# EAGLE design shiftLight (EAGLE 7.1.0)
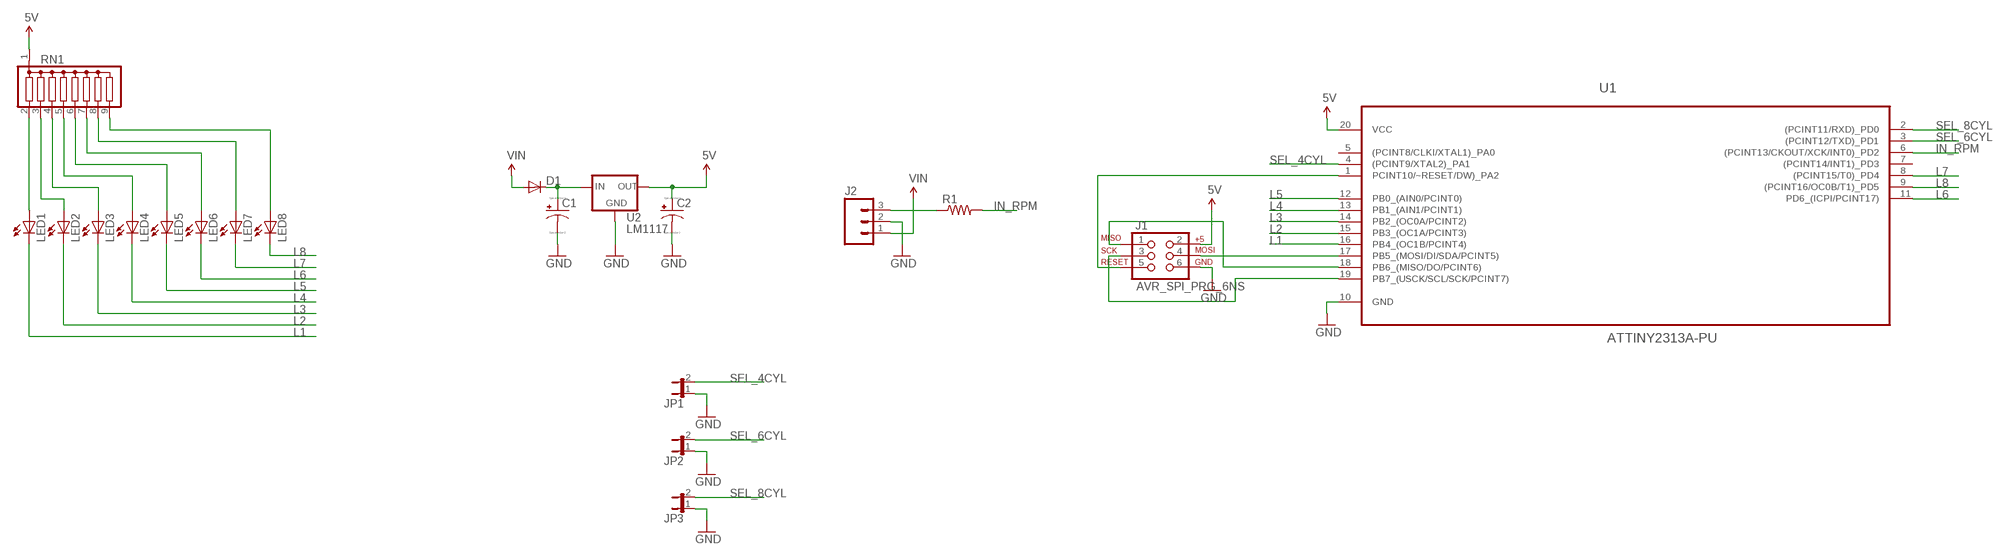
[diagram p0: schematic, sheet 1]

## Parts
C1  CPOL-USE3.5-8  [E3,5-8]
C2  CPOL-USE3.5-8  [E3,5-8]
D1  DIODEPTH  [DIODE-1N4001]
J1  AVR_SPI_PRG_6NS  [2X3-NS]
J2  M03SCREW  [SCREWTERMINAL-3.5MM-3]
JP1  JUMPER-2SMD-NO  [SJ_2S-NO]
JP2  JUMPER-2SMD-NO  [SJ_2S-NO]
JP3  JUMPER-2SMD-NO  [SJ_2S-NO]
LED1  LED5MM  [LED5MM]
LED2  LED5MM  [LED5MM]
LED3  LED5MM  [LED5MM]
LED4  LED5MM  [LED5MM]
LED5  LED5MM  [LED5MM]
LED6  LED5MM  [LED5MM]
LED7  LED5MM  [LED5MM]
LED8  LED5MM  [LED5MM]
R1  RESISTORPTH-1/4W  [AXIAL-0.4]
RN1  G08R  [SIL9]
U1  ATTINY2313A-PU  [DIP254P762X533-20]
U2  LM1117  V_REG_78XX-TO-220  [TO-220-ALT]

## Nets
5V: C2.+ J1.2 RN1.1 U1.20(VCC) U2.OUT
GND: C1.- C2.- J1.6 J2.2 JP1.1 JP2.1 JP3.1 U1.10(GND) U2.GND
IN_RPM: R1.P$2 U1.6((PCINT13/CKOUT/XCK/INT0)_PD2)
L1: LED1.K(C) U1.16(PB4_(OC1B/PCINT4))
L2: LED2.K(C) U1.15(PB3_(OC1A/PCINT3))
L3: LED3.K(C) U1.14(PB2_(OC0A/PCINT2))
L4: LED4.K(C) U1.13(PB1_(AIN1/PCINT1))
L5: LED5.K(C) U1.12(PB0_(AIN0/PCINT0))
L6: LED6.K(C) U1.11(PD6_(ICPI/PCINT17))
L7: LED7.K(C) U1.8((PCINT15/T0)_PD4)
L8: LED8.K(C) U1.9((PCINT16/OC0B/T1)_PD5)
N$1: LED1.A RN1.2
N$2: LED2.A RN1.3
N$3: LED3.A RN1.4
N$4: LED4.A RN1.5
N$5: LED5.A RN1.6
N$6: LED6.A RN1.7
N$7: LED7.A RN1.8
N$8: J2.3 R1.P$1
N$9: C1.+ D1.C U2.IN
N$10: J1.4 U1.17(PB5_(MOSI/DI/SDA/PCINT5))
N$11: J1.3 U1.19(PB7_(USCK/SCL/SCK/PCINT7))
N$12: J1.1 U1.18(PB6_(MISO/DO/PCINT6))
N$13: J1.5 U1.1(PCINT10/~RESET/DW)_PA2)
N$14: LED8.A RN1.9
SEL_4CYL: JP1.2 U1.4((PCINT9/XTAL2)_PA1)
SEL_6CYL: JP2.2 U1.3((PCINT12/TXD)_PD1)
SEL_8CYL: JP3.2 U1.2((PCINT11/RXD)_PD0)
VIN: D1.A J2.1
Unconnected: U1.5((PCINT8/CLKI/XTAL1)_PA0) U1.7((PCINT14/INT1)_PD3)

## Library data of the parts
C1 C2 = resistor:CPOL-US: POLARIZED CAPACITOR, American symbol
D1 = SparkFun-DiscreteSemi:DIODE: Diode These are standard reverse protection diodes and small signal diodes. SMA package can handle up to about 1A. SOD-323 can handle about 200mA. What the SOD-323 package when ordering, there are some mfgs out there that are 5-pin packages.
J1 = SparkFun-Connectors:AVR_SPI_PRG_6: AVR ISP 6 Pin This is the reduced ISP connector for AVR programming. Common on Arduino. This footprint will take up less PCB space and can be used with a 10-pin to 6-pin adapter such as SKU: BOB-08508
J2 = SparkFun-Connectors:M03: Header 3 Standard 3-pin 0.1" header. Use with straight break away headers (SKU : PRT-00116), right angle break away headers (PRT-00553), swiss pins (PRT-00743), machine pins (PRT-00117), and female headers (PRT-00115). Molex polarized connector foot print use with SKU : PRT-08232 with associated crimp pins and housings.
JP1-JP3 = SparkFun-Passives:JUMPER-2: Jumper Basic 0.1" spaced jumper. Use with breakaway headers.
LED1-LED8 = SparkFun-LED:LED: LEDs Standard schematic elements and footprints for 5mm, 3mm, 1206, and 0603 sized LEDs. 5mm - Spark Fun Electronics SKU : COM-00529 (and others)
R1 = SparkFun-Resistors:RESISTOR: Resistor Basic schematic elements and footprints for 0603, 1206, and PTH resistors.
RN1 = resistor-sil:G08R: SIL RESISTOR; OC_FARNELL: unknown; OC_NEWARK: unknown
U1 = Atmel_By_element14_Batch_1-00:ATTINY2313A-PU: 8-bit Microcontroller; DESCRIPTION: 8-bit Microcontroller; MPN: ATTINY2313A-PU; OC_FARNELL: 1841616; OC_NEWARK: 12T1333; PACKAGE: DIP-20; SUPPLIER: Atmel
U2 = SparkFun-PowerIC:V_REG_78XX: Voltage Regulator Standard 7805 5V regulator. IGO (Input Ground Output). Spark Fun Electronics SKU : COM-00107

## Board
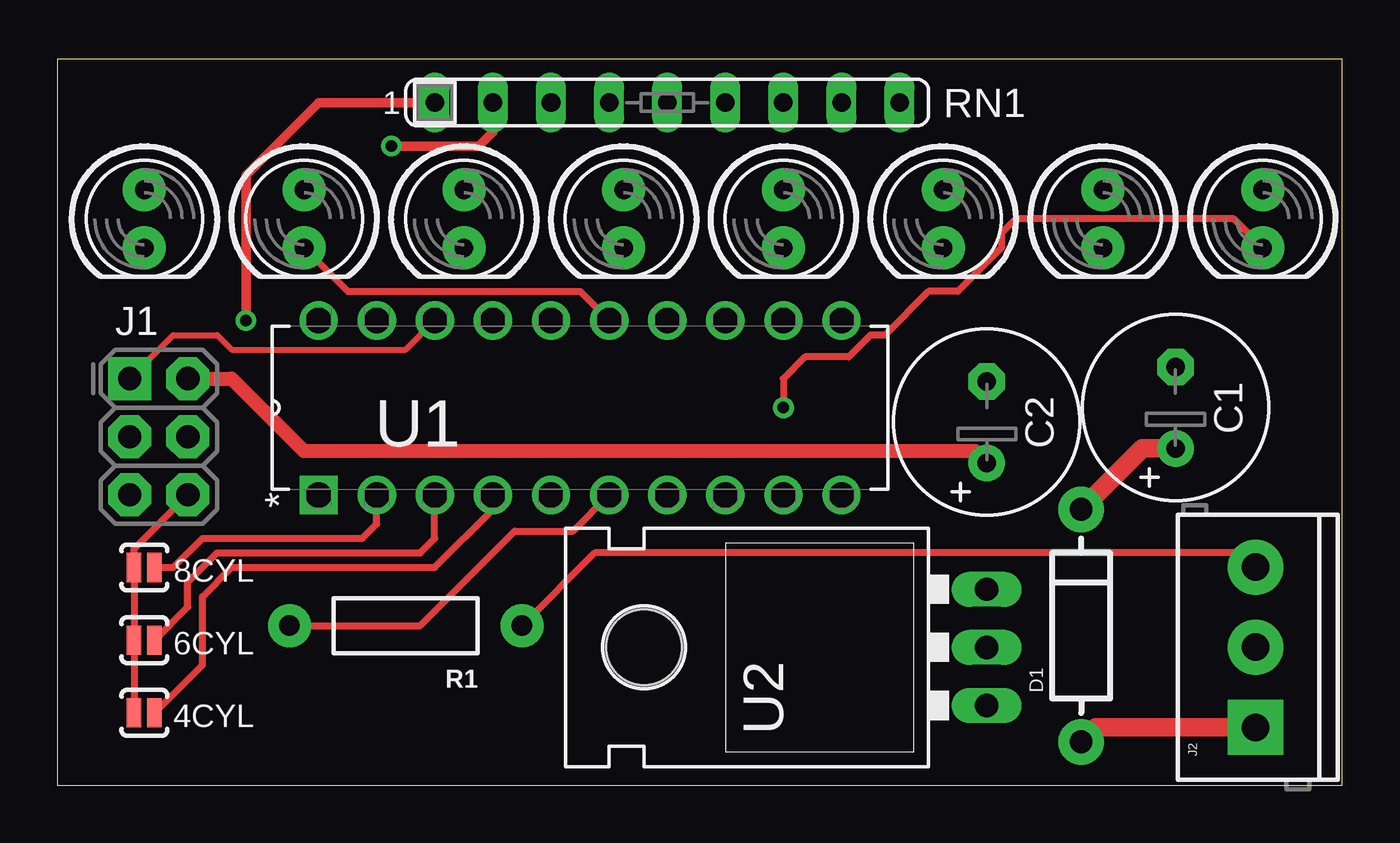
[diagram p1: board, top side]
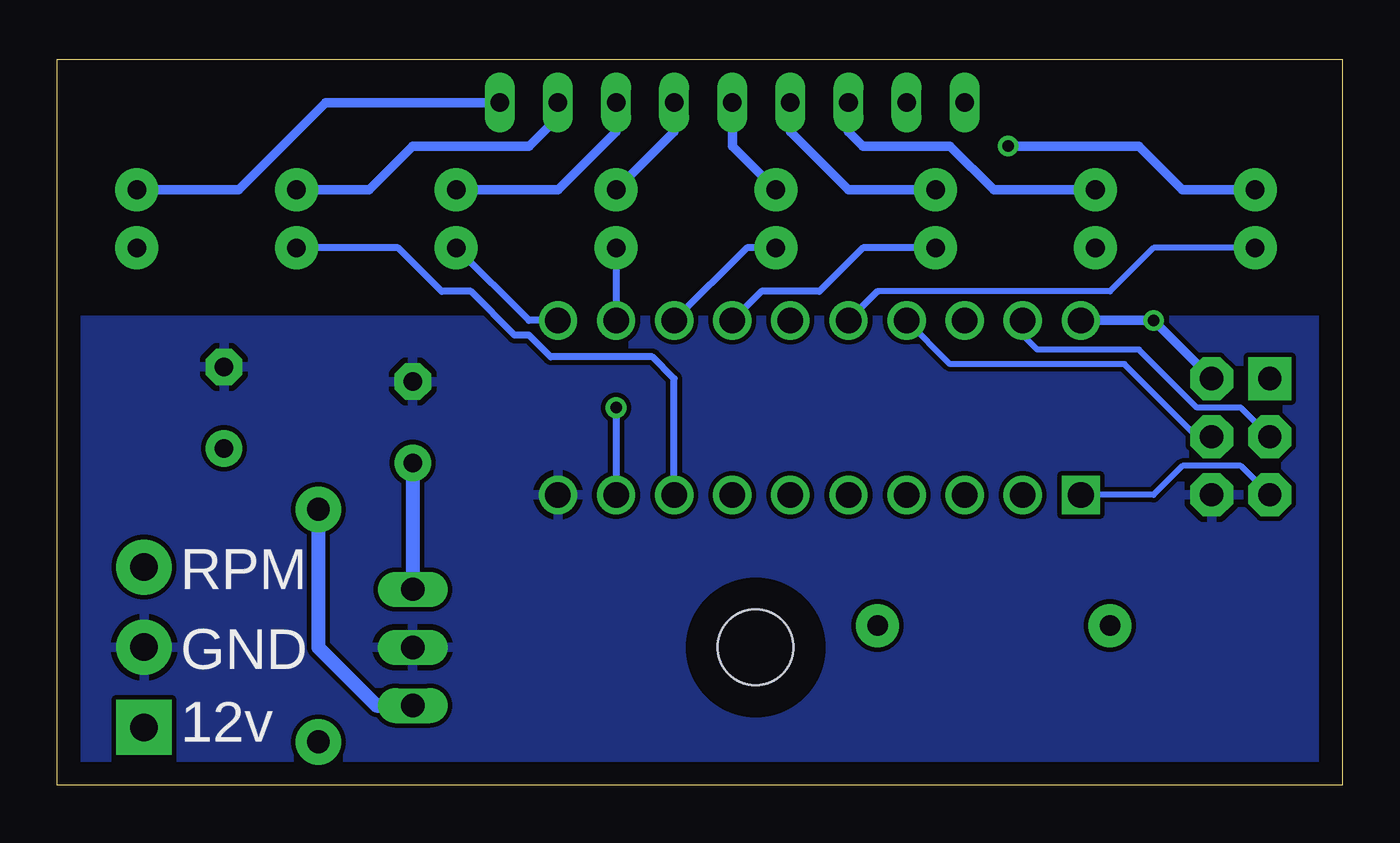
[diagram p2: board, bottom side, seen from below]

Size 56.19 x 31.74 mm. Coordinates in mm from the lower left corner, seen from the top.
Outline: 0,0 56.19,0 56.19,31.74 0,31.74 0,0
Copper layers (1*16): Top 0.035mm / dielectric 1.5mm / Bottom 0.035mm
Design rules "default": minimum track width 10mil, minimum drill 24mil, track to track 8mil, track to pad 8mil, pad to pad 8mil, via to via 8mil, smd to smd 8mil, copper to edge 40mil, drill to drill 8mil, minimum pad ring 10mil, minimum via ring 8mil, stop-mask expansion 4mil, vias tented up to drill 0mil, thermal gap 10mil

### Footprints (pad centres in the part's own frame; a part is rotated, then mirrored left to right if it is on the bottom)
E3,5-8 = drill 0.813 pad 1.6: + -1.778,0 | drill 0.813 pad 1.6 octagon: - 1.778,0
DIODE-1N4001 = drill 1 pad 1.981: A -5.08,0; C 5.08,0
2X3-NS = drill 1.016 pad 1.88 square: 1 -2.54,-1.27 | drill 1.016 pad 1.88 octagon: 2 -2.54,1.27; 3 0,-1.27; 4 0,1.27; 5 2.54,-1.27; 6 2.54,1.27
SCREWTERMINAL-3.5MM-3 = drill 1.2 pad 2.413 square: 1 0,0 | drill 1.2 pad 2.413: 2 3.5,0; 3 7,0
SJ_2S-NO = smd 0.635 x 1.27: 1 -0.45,0; 2 0.45,0
LED5MM = drill 0.813 pad 1.88: A -1.27,0; K 1.27,0
AXIAL-0.4 = drill 0.9 pad 1.88: P$1 -5.08,0; P$2 5.08,0
SIL9 = drill 0.813 long: 1 -10.16,0; 2 -7.62,0; 3 -5.08,0; 4 -2.54,0; 5 0,0; 6 2.54,0; 7 5.08,0; 8 7.62,0; 9 10.16,0
DIP254P762X533-20 = drill 1.118 square: 1 -7.62,22.86 | drill 1.118: 2 -7.62,20.32; 3 -7.62,17.78; 4 -7.62,15.24; 5 -7.62,12.7; 6 -7.62,10.16; 7 -7.62,7.62; 8 -7.62,5.08; 9 -7.62,2.54; 10 -7.62,0; 11 0,0; 12 0,2.54; 13 0,5.08; 14 0,7.62; 15 0,10.16; 16 0,12.7; 17 0,15.24; 18 0,17.78; 19 0,20.32; 20 0,22.86
TO-220-ALT = drill 1.016 long: GND 0,-3.81; IN -2.54,-3.81; OUT 2.54,-3.81 | hole 3.302: 0,11.176

### Placement (x,y rotation side)
C1  48.9,16.51 90 top
C2  40.64,15.88 90 top
D1  44.77,6.99 90 top
J1  4.45,15.24 270 top
J2  52.39,2.54 90 top
JP1  3.81,3.17 0 top
JP2  3.81,6.35 0 top
JP3  3.81,9.53 0 top
LED1  3.81,24.77 270 top
LED2  10.79,24.77 270 top
LED3  17.78,24.77 270 top
LED4  24.77,24.77 270 top
LED5  31.75,24.77 270 top
LED6  38.73,24.77 270 top
LED7  45.72,24.77 270 top
LED8  52.7,24.77 270 top
R1  15.24,6.99 180 top
RN1  26.67,29.84 0 top
U1  34.29,20.32 90 top
U2  36.83,6.03 90 top

### Tracks (layer width: path | path; a pad name or v marks a point on that pad's centre or on a via)
5V  (via drill 0.5)
  Top 0.406: RN1.1 11.43,29.84 8.26,26.67 v8.26,20.32
  Top 0.61: J1.2 7.62,17.78 10.79,14.61 40.13,14.61 C2.+
  Bottom 0.406: J1.2 v8.26,20.32 U1.20
  Bottom 0.61: C2.+ U2.OUT
GND
  Top 0.305: JP1.1 JP2.1 JP3.1 3.36,10.35 J1.6
  pour Bottom: 0,20.32 55.88,20.32 55.88,0 0,0
IN_RPM
  Top 0.305: R1.P$2 15.88,6.99 20,11.11 22.54,11.11 U1.6
L1
  Bottom 0.254: LED1.K 8.26,23.5 10.16,21.59 20.32,21.59
  Bottom 0.305: 20.32,21.59 U1.16
L2
  Top 0.305: LED2.K 12.7,21.59 22.86,21.59 U1.15
L3
  Bottom 0.305: LED3.K 20.95,23.5 22.86,21.59 25.4,21.59 U1.14
L4
  Bottom 0.305: LED4.K 26.04,23.5 U1.13
L5
  Bottom 0.305: LED5.K U1.12
L6
  Bottom 0.305: U1.11 35.56,20.32 LED6.K
L7
  Bottom 0.305: U1.8 29.21,17.78 30.16,18.73 34.61,18.73 35.56,19.68 36.2,19.68 38.1,21.59 39.37,21.59 41.27,23.5 LED7.K
L8  (via drill 0.5)
  Top 0.305: LED8.K 51.44,24.77 41.91,24.77 41.27,24.13 41.27,23.5 39.37,21.59 38.1,21.59 36.2,19.68 35.56,19.68 34.61,18.73 32.7,18.73 31.75,17.78 v31.75,16.51
  Bottom 0.305: v31.75,16.51 U1.9
N$1  (via drill 0.5)
  Top 0.406: RN1.2 19.05,28.57 18.41,27.94 v14.61,27.94
  Bottom 0.406: LED1.A 6.99,26.04 8.89,27.94 v14.61,27.94
N$2
  Bottom 0.406: RN1.3 21.59,28.57 20.95,27.94 17.14,27.94 15.24,26.04 LED2.A
N$3
  Bottom 0.406: RN1.4 24.13,28.57 21.59,26.04 LED3.A
N$4
  Bottom 0.406: RN1.5 26.67,27.94 LED4.A
N$5
  Bottom 0.406: RN1.6 29.21,28.57 LED5.A
N$6
  Bottom 0.406: RN1.7 31.75,28.57 34.29,26.04 LED6.A
N$7
  Bottom 0.406: RN1.8 34.29,29.21 35.56,27.94 40.64,27.94 42.55,26.04 LED7.A
N$8
  Top 0.305: J2.3 51.77,10.16 23.5,10.16 R1.P$1
N$9
  Top 0.813: D1.C 47.43,14.73 C1.+
  Bottom 0.61: D1.C 44.77,6.03 42.23,3.49 U2.IN
N$10
  Bottom 0.254: J1.4 6.35,15.24 9.53,18.41 17.14,18.41 U1.17
N$11
  Bottom 0.254: J1.3 4.45,16.51 6.35,16.51 8.89,19.05 13.34,19.05 13.97,19.68 U1.19
N$12
  Top 0.254: J1.1 5.08,19.68 6.99,19.68 7.62,19.05 15.24,19.05 U1.18
N$13
  Bottom 0.254: J1.5 4.45,13.97 6.99,13.97 8.26,12.7 U1.1
N$14
  Bottom 0.406: RN1.9 44.45,29.84 48.26,26.04 LED8.A
SEL_4CYL
  Top 0.305: JP1.2 6.35,5.26 6.35,8.26 7.62,9.53 16.51,9.53 19.05,12.06 U1.4
SEL_6CYL
  Top 0.305: JP2.2 5.71,7.8 5.71,8.89 6.99,10.16 15.88,10.16 16.51,10.79 U1.3
SEL_8CYL
  Top 0.305: JP3.2 5.08,9.53 6.35,10.79 13.34,10.79 13.97,11.43 U1.2
VIN
  Top 0.813: D1.A 45.4,2.54 J2.1

### Text on the board
tNames: 8CYL | 6CYL | 4CYL
bNames: RPM | GND | 12v